# EAGLE design IdealDiodeSwitcher_2023_05_02_A (EAGLE 9.6.1)
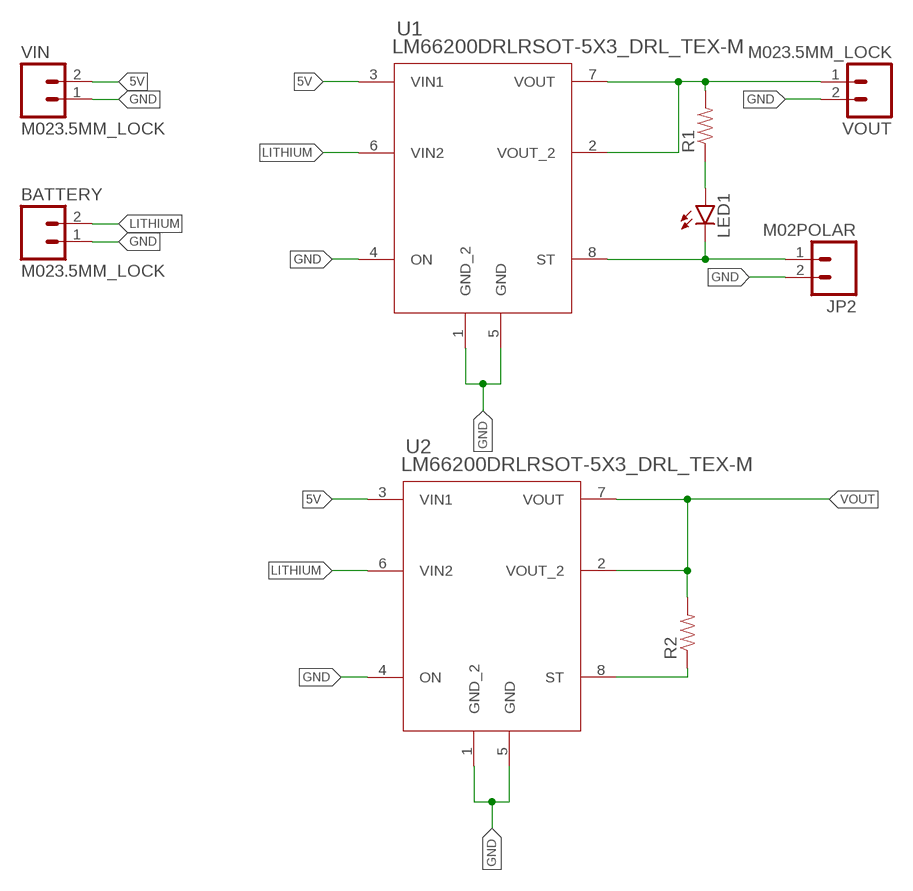
[diagram p0: schematic, sheet 1]

## Parts
BATTERY  M023.5MM_LOCK  [SCREWTERMINAL-3.5MM-2_LOCK]
JP2  M02POLAR  [MOLEX-1X2]
LED1  LED1206  [LED-1206]
R1  RESISTOR1206  [1206]
R2  RESISTOR1206  [1206]
U1  LM66200DRLRSOT-5X3_DRL_TEX-M  [SOT-5X3_DRL_TEX-M]
U2  LM66200DRLRSOT-5X3_DRL_TEX-M  [SOT-5X3_DRL_TEX-M]
VIN  M023.5MM_LOCK  [SCREWTERMINAL-3.5MM-2_LOCK]
VOUT  M023.5MM_LOCK  [SCREWTERMINAL-3.5MM-2_LOCK]

## Nets
5V: U1.3(VIN1) U2.3(VIN1) VIN.2
GND: BATTERY.1 JP2.2 U1.1(GND_2) U1.4(ON) U1.5(GND) U2.1(GND_2) U2.4(ON) U2.5(GND) VIN.1 VOUT.2
LITHIUM: BATTERY.2 U1.6(VIN2) U2.6(VIN2)
N$2: LED1.A R1.1
STAT: JP2.1 LED1.C U1.8(ST)
STAT1: R2.1 U2.8(ST)
VOUT: R1.2 R2.2 U1.2(VOUT_2) U1.7(VOUT) U2.2(VOUT_2) U2.7(VOUT) VOUT.1

## Library data of the parts
BATTERY JP2 VIN VOUT = SparkFun-Connectors:M02: Standard 2-pin 0.1" header. Use with - straight break away headers ( PRT-00116) - right angle break away headers (PRT-00553) - swiss pins (PRT-00743) - machine pins (PRT-00117) - female headers (PRT-00115) Molex polarized connector foot print use with: PRT-08233 with associated crimp pins and housings. 2.54_SCREWTERM for use with PRT-10571. 3.5mm Screw Terminal footprints for PRT-08084 5mm Screw Terminal footprints for use with PRT-08432
LED1 = SparkFun-LED:LED: LEDs Standard schematic elements and footprints for 5mm, 3mm, 1206, and 0603 sized LEDs. 5mm - Spark Fun Electronics SKU : COM-00529 (and others)
R1 R2 = SparkFun-Resistors:RESISTOR: Resistor Basic schematic elements and footprints for 0603, 1206, and PTH resistors.
U1 U2 = LM66200:LM66200DRLR: The LM66200 is a dual ideal diode device with a voltage rating of 1.6 V to 5.5 V and a maximum current rating of 2.5 A per channel; COPYRIGHT: Copyright (C) 2023 Ultra Librarian. All rights reserved.; MANUFACTURER_PART_NUMBER: LM66200DRLR; MFR_NAME: Texas Instruments

## Board
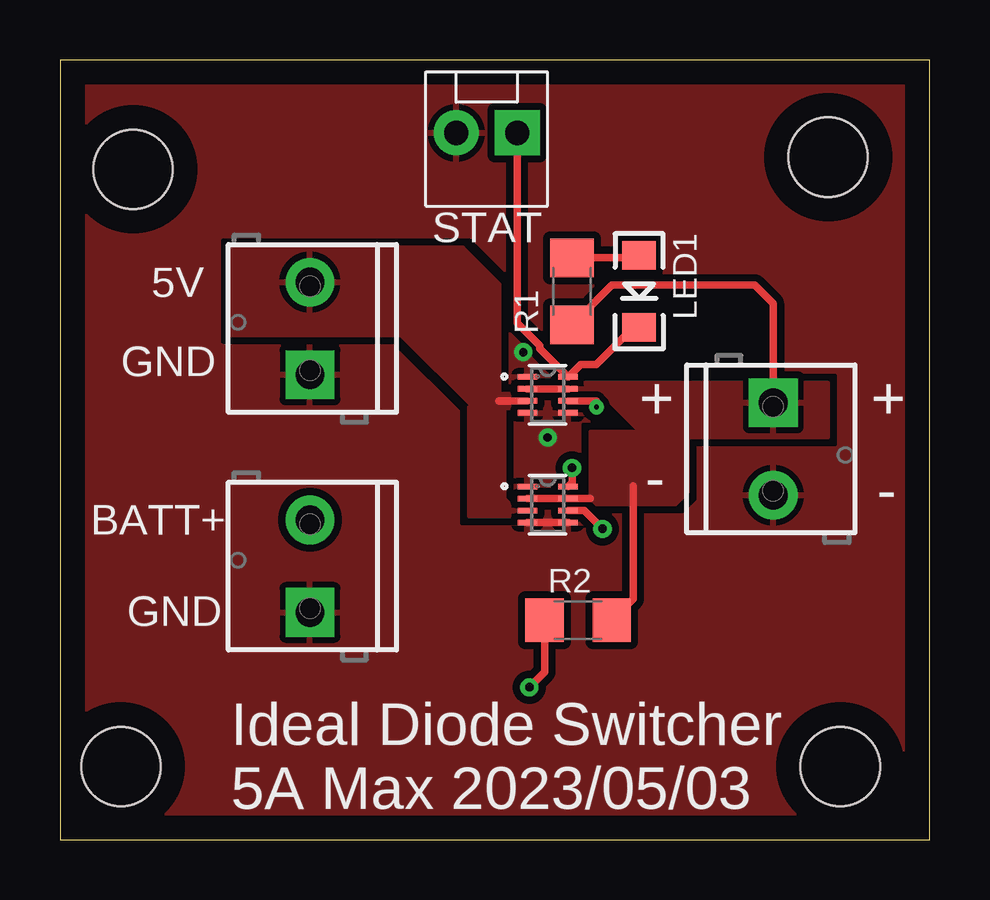
[diagram p1: board, top side]
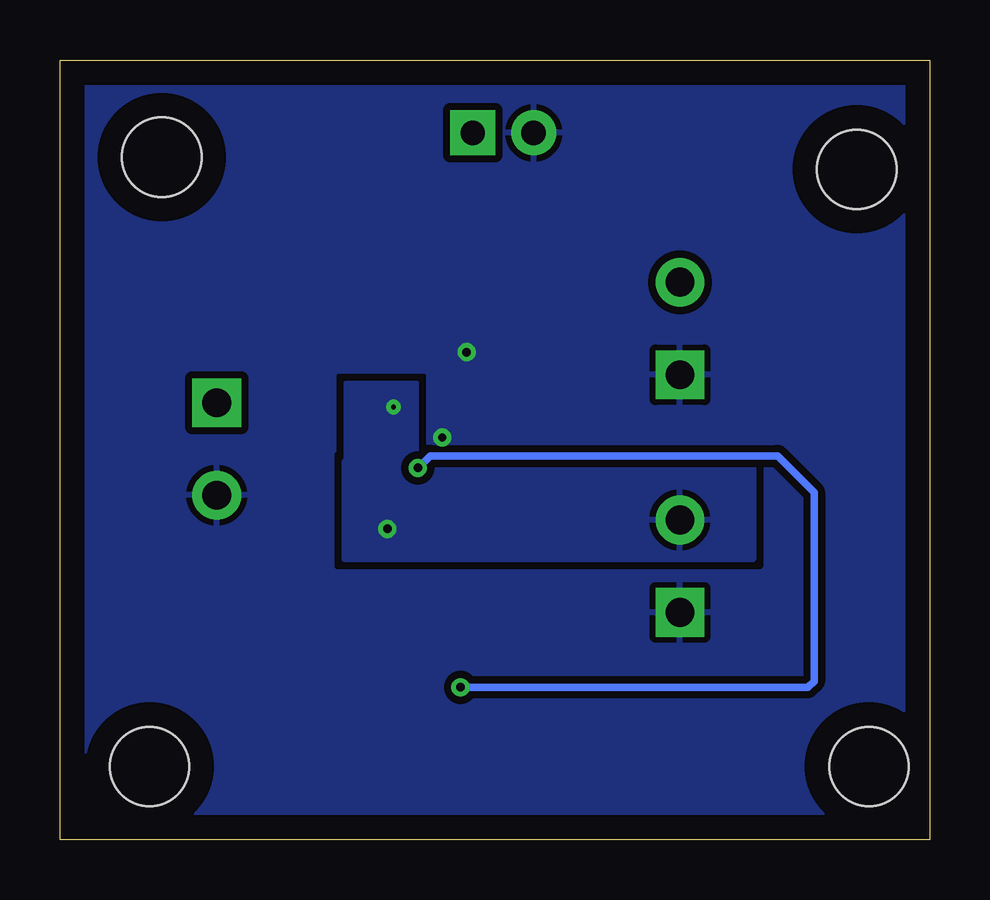
[diagram p2: board, bottom side, seen from below]

Size 36.25 x 32.5 mm. Coordinates in mm from the lower left corner, seen from the top.
Outline: 0,0 36.25,0 36.25,32.5 0,32.5 0,0
Copper layers (1*16): Top 0.035mm / dielectric 1.5mm / Bottom 0.035mm
Design rules "default": minimum track width 12mil, minimum drill 0.35mm, track to track 6mil, track to pad 6mil, pad to pad 6mil, via to via 6mil, smd to smd 6mil, copper to edge 40mil, drill to drill 6mil, minimum pad ring 10mil, minimum via ring 8mil, stop-mask expansion 4mil, vias tented up to drill 0mil, thermal gap 10mil
Holes 3.3 mm at 3.05,27.94 32,28.45 32.51,3.05 2.54,3.05

### Footprints (pad centres in the part's own frame; a part is rotated, then mirrored left to right if it is on the bottom)
SCREWTERMINAL-3.5MM-2_LOCK = drill 1.2 pad 2.032 square: 1 -0.178,0 | drill 1.2 pad 2.032: 2 3.678,0
MOLEX-1X2 = drill 1.016 pad 1.88 square: 1 0,0 | drill 1.016 pad 1.88: 2 2.54,0
LED-1206 = smd 1.2 x 1.4: A -1.5,0; C 1.5,0
1206 = smd 1.6 x 1.8: 1 -1.4,0; 2 1.4,0
SOT-5X3_DRL_TEX-M = smd 0.813 x 0.229: 1 -0.851,0.75; 2 -0.851,0.25; 3 -0.851,-0.25; 4 -0.851,-0.75; 5 0.851,-0.75; 6 0.851,-0.25; 7 0.851,0.25; 8 0.851,0.75

### Placement (x,y rotation side)
BATTERY  10.41,9.65 90 top
JP2  19.05,29.46 180 top
LED1  24.13,22.86 270 top
R1  21.34,22.86 270 top
R2  21.59,9.14 0 top
U1  20.32,18.54 0 top
U2  20.32,13.97 0 top
VIN  10.41,19.56 90 top
VOUT  29.72,18.03 270 top

### Tracks (layer width: path | path; a pad name or v marks a point on that pad's centre or on a via)
5V
  Top 0.305: U1.3 18.29,18.29
  pour Top (isolate 0.305): 16.76,24.64 7.11,24.64 7.11,21.08 14.22,21.08 17.27,18.03 19.05,18.03 19.05,18.54 18.29,18.54 18.29,23.11
  pour Top (isolate 0.305): 19.56,13.97 18.8,13.97 18.54,14.22 18.54,18.03 17.02,18.03 17.02,13.46 19.56,13.46
GND  (via drill 0.35)
  Top 0.305: U2.5 U2.4
  other vias: 19.3,20.32 20.32,16.76
  pour Top (isolate 0.305, rank 6): 0.51,32.51 35.56,32.51 35.56,-0.51 -1.02,-0.51 -1.02,32 -0.51,32.51
  pour Bottom (isolate 0.305, rank 6): 0.51,33.02 36.58,33.02 36.58,-1.78 -1.02,-1.78 -1.27,-1.52 -1.27,31.24
LITHIUM  (via drill 0.2, 0.35)
  Top 0.305: U1.6 22.35,18.29 v22.35,18.03 | U2.6 21.84,13.72 v22.61,12.95
  pour Bottom (isolate 0.305): 7.37,15.75 7.37,11.68 24.38,11.68 24.38,15.75
  pour Bottom (isolate 0.305): 21.84,19.05 24.38,19.05 24.38,15.75 21.34,15.75 21.34,19.05
N$2
  Top 0.305: LED1.A 24.03,24.26 R1.1
STAT
  Top 0.305: LED1.C 23.9,21.36 22.35,19.81 21.69,19.81 U1.8 19.99,20.48 19.99,20.6 19.05,21.54 JP2.1
STAT1  (via drill 0.35)
  Top 0.305: U2.8 21.34,14.88 v21.34,15.49 | v19.56,6.35 20.19,6.98 R2.1
  Bottom 0.305: v21.34,15.49 20.83,16 6.35,16 4.83,14.48 4.83,6.6 5.08,6.35 v19.56,6.35
VOUT
  Top 0.305: U1.2 U1.7 | R1.2 22.99,23.11 28.96,23.11 29.72,22.35 VOUT.1 | U2.2 U2.7 22.1,14.22 | R2.2 23.88,10.03 23.88,14.73
  pour Top (isolate 0.254): 20.83,19.05 32,19.05 32,16.76 24.38,16.76 22.61,18.54 20.83,18.54
  pour Top (isolate 0.305): 22.1,13.97 25.65,13.97 26.16,14.48 26.16,17.02 22.1,17.02

### Text on the board
tPlace: STAT | 5V | GND | + | + | - | - | BATT+ | GND | Ideal Diode Switcher / 5A Max 2023/05/03